# EAGLE design Relay_Board (EAGLE 7.7.0)
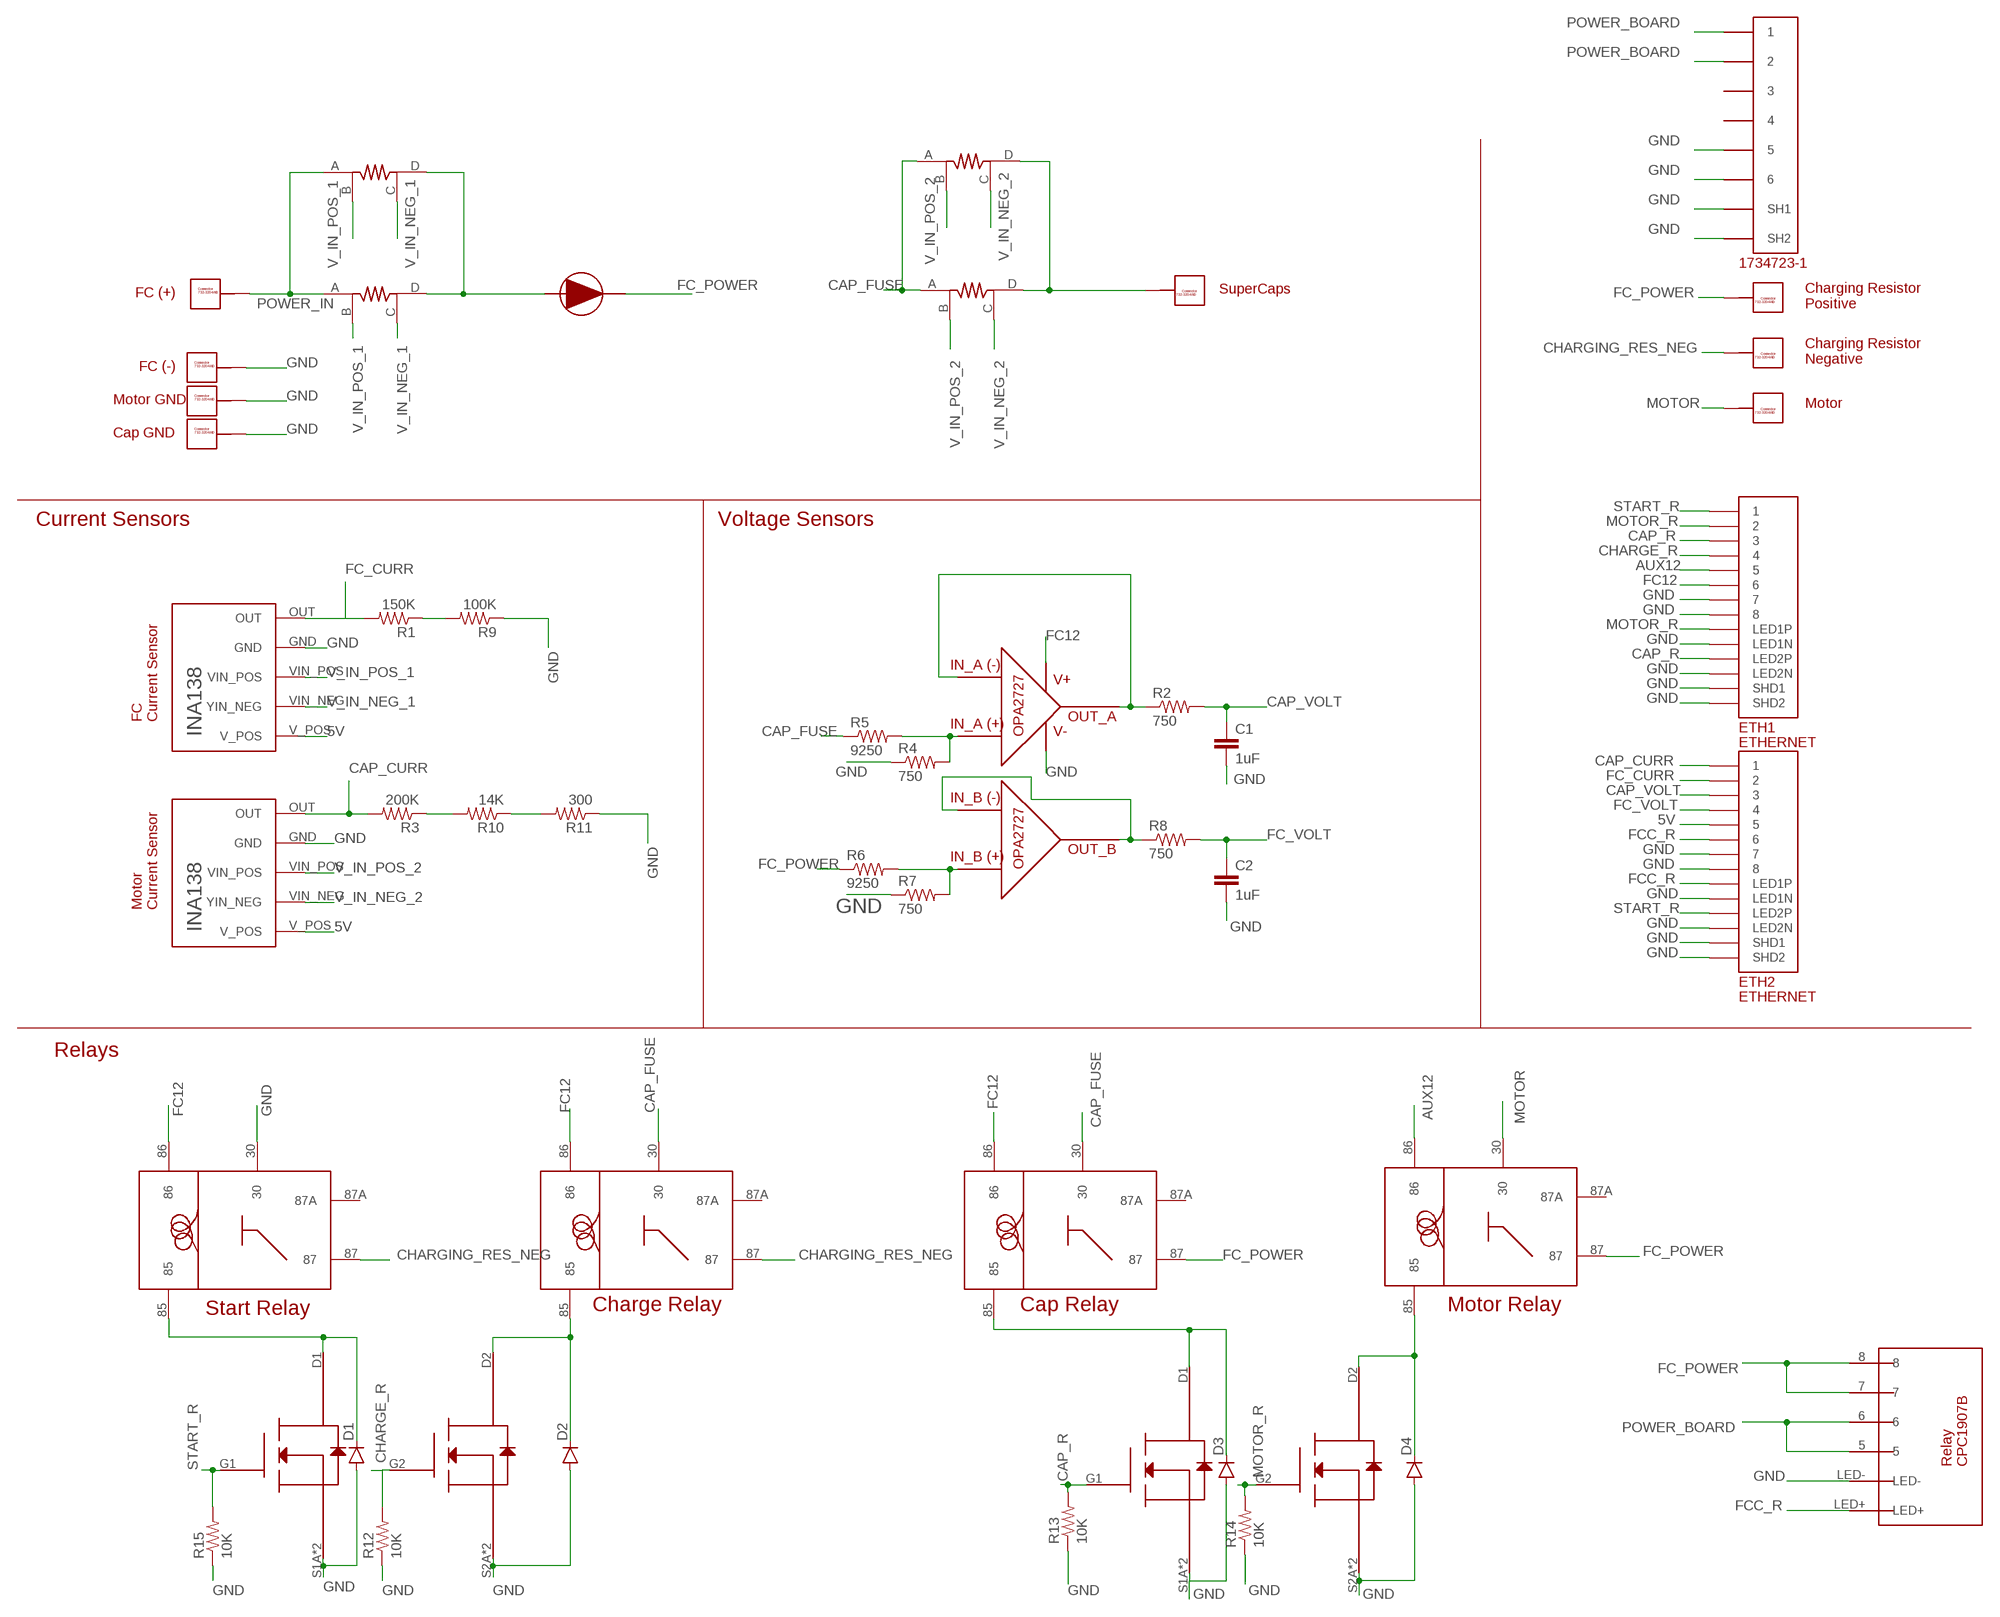
[diagram p0: schematic, sheet 1]

## Parts
C1  1uF  CAP0402-CAP  [0402-CAP]
C2  1uF  CAP0402-CAP  [0402-CAP]
D1  DIODESOD123  [SOD-123]
D2  DIODESOD123  [SOD-123]
D3  DIODESOD123  [SOD-123]
D4  DIODESOD123  [SOD-123]
ETH1  ETHERNET  [A122645-ND]
ETH2  ETHERNET  [A122645-ND]
R1  150K  RESISTOR1206  [1206]
R2  750  RESISTOR1206  [1206]
R3  200K  RESISTOR1206  [1206]
R4  750  RESISTOR1206  [1206]
R5  9250  RESISTOR1206  [1206]
R6  9250  RESISTOR1206  [1206]
R7  750  RESISTOR1206  [1206]
R8  750  RESISTOR1206  [1206]
R9  100K  RESISTOR1206  [1206]
R10  14K  RESISTOR1206  [1206]
R11  300  RESISTOR1206  [1206]
R12  10K  RESISTOR0603-RES  [0603-RES]
R13  10K  RESISTOR0603-RES  [0603-RES]
R14  10K  RESISTOR0603-RES  [0603-RES]
R15  10K  RESISTOR0603-RES  [0603-RES]
U$1  732-3204-ND_CONNECTOR  [732-3204-ND]
U$2  732-3204-ND_CONNECTOR  [732-3204-ND]
U$3  TI_INA138  [TI_INA138]
U$4  SHUNT_RESISTOR_CSM3637  [CSM3637]
U$5  DIODE-APT60S20BG  [DIODE-APT60S20BG]
U$6  SHUNT_RESISTOR_CSM3637  [CSM3637]
U$7  TI_INA138  [TI_INA138]
U$8  VCF4-1000  [VCF4-1000]
U$9  SI6926ADQ-T1-E3CT-ND_MOSFET  [SI6926ADQ-T1-E3CT-ND_MOSFET]
U$10  732-3204-ND_CONNECTOR  [732-3204-ND]
U$11  VCF4-1000  [VCF4-1000]
U$12  SHUNT_RESISTOR_CSM3637  [CSM3637]
U$13  732-3204-ND_CONNECTOR  [732-3204-ND]
U$14  732-3204-ND_CONNECTOR  [732-3204-ND]
U$15  VCF4-1000  [VCF4-1000]
U$17  OP-AMP_OPA2727AIDR  [OP-AMP_OPA2727AIDR]
U$18  VCF4-1000  [VCF4-1000]
U$19  5555140-6  [1734723-1_RJ11]
U$20  732-3204-ND_CONNECTOR  [732-3204-ND]
U$21  SHUNT_RESISTOR_CSM3637  [CSM3637]
U$22  RELAY-CPC1907B  [RELAY-CPC1907B]
U$23  732-3204-ND_CONNECTOR  [732-3204-ND]
U$24  732-3204-ND_CONNECTOR  [732-3204-ND]
U$25  SI6926ADQ-T1-E3CT-ND_MOSFET  [SI6926ADQ-T1-E3CT-ND_MOSFET]

## Nets
5V: ETH2.P$5 U$3.V_POS U$7.V_POS
AUX12: ETH1.P$5 U$18.86
CAP_CURR: ETH2.P$1 R3.2 U$3.OUT
CAP_FUSE: R5.1 U$8.30 U$11.30 U$12.A U$21.A
CAP_R: ETH1.P$3 ETH1.P$12(LED2P) R13.2 U$9.G1
CAP_VOLT: C1.1 ETH2.P$3 R2.2
CHARGE_R: ETH1.P$4 R12.2 U$25.G2
CHARGING_RES_NEG: U$11.87 U$14.P$1 U$14.P$2 U$14.P$3 U$14.P$4 U$14.P$5 U$14.P$6 U$14.P$7 U$14.P$8 U$14.P$9 U$14.P$10 U$15.87
FC12: ETH1.P$6 U$8.86 U$11.86 U$15.86 U$17.V+
FC_CURR: ETH2.P$2 R1.2 U$7.OUT
FC_POWER: R6.1 U$5.CATHODE U$8.87 U$13.P$1 U$13.P$2 U$13.P$3 U$13.P$4 U$13.P$5 U$13.P$6 U$13.P$7 U$13.P$8 U$13.P$9 U$13.P$10 U$18.87 U$22.7 U$22.8
FC_VOLT: C2.1 ETH2.P$4 R8.2
FCC_R: ETH2.P$6 ETH2.P$10(LED1P) U$22.LED+
GND: C1.2 C2.2 D1.A D2.A D3.A D4.A ETH1.P$7 ETH1.P$8 ETH1.P$9(LED1N) ETH1.P$11(LED2N) ETH1.P$13(SHD1) ETH1.P$14(SHD2) ETH2.P$7 ETH2.P$8 ETH2.P$9(LED1N) ETH2.P$11(LED2N) ETH2.P$13(SHD1) ETH2.P$14(SHD2) R4.1 R7.1 R9.1 R11.1 R12.1 R13.1 R14.1 R15.1 U$2.P$1 U$2.P$2 U$2.P$3 U$2.P$4 U$2.P$5 U$2.P$6 U$2.P$7 U$2.P$8 U$2.P$9 U$2.P$10 U$3.GND U$7.GND U$9.S1A(S1) U$9.S1B(S1) U$9.S2A(S2) U$9.S2B(S2) U$15.30 U$17.V- U$19.5 U$19.6 U$19.SH1 U$19.SH2 U$22.LED- U$23.P$1 U$23.P$2 U$23.P$3 U$23.P$4 U$23.P$5 U$23.P$6 U$23.P$7 U$23.P$8 U$23.P$9 U$23.P$10 U$24.P$1 U$24.P$2 U$24.P$3 U$24.P$4 U$24.P$5 U$24.P$6 U$24.P$7 U$24.P$8 U$24.P$9 U$24.P$10 U$25.S1A(S1) U$25.S1B(S1) U$25.S2A(S2) U$25.S2B(S2)
MOTOR: U$18.30 U$20.P$1 U$20.P$2 U$20.P$3 U$20.P$4 U$20.P$5 U$20.P$6 U$20.P$7 U$20.P$8 U$20.P$9 U$20.P$10
MOTOR_R: ETH1.P$2 ETH1.P$10(LED1P) R14.2 U$9.G2
N$1: R1.1 R9.2
N$3: D3.C U$8.85 U$9.D1
N$5: D1.C U$15.85 U$25.D1
N$7: D2.C U$11.85 U$25.D2
N$9: R4.2 R5.2 U$17.IN_A+
N$10: R6.2 R7.2 U$17.IN_B+
N$11: R8.1 U$17.IN_B- U$17.OUT_B
N$12: R2.1 U$17.IN_A- U$17.OUT_A
N$25: R3.1 R10.2
N$26: R10.1 R11.2
N$29: D4.C U$9.D2 U$18.85
POWER_BOARD: U$19.1 U$19.2 U$22.5 U$22.6
POWER_IN: U$1.P$1 U$1.P$2 U$1.P$3 U$1.P$4 U$1.P$5 U$1.P$6 U$1.P$7 U$1.P$8 U$1.P$9 U$1.P$10 U$4.A U$6.A
SHUNT_RES_1: U$4.D U$5.ANODE U$6.D
START_R: ETH1.P$1 ETH2.P$12(LED2P) R15.2 U$25.G1
SUPERCAPS: U$10.P$1 U$10.P$2 U$10.P$3 U$10.P$4 U$10.P$5 U$10.P$6 U$10.P$7 U$10.P$8 U$10.P$9 U$10.P$10 U$12.D U$21.D
V_IN_NEG_1: U$4.C U$6.C U$7.VIN_NEG(YIN_NEG)
V_IN_NEG_2: U$3.VIN_NEG(YIN_NEG) U$12.C U$21.C
V_IN_POS_1: U$4.B U$6.B U$7.VIN_POS
V_IN_POS_2: U$3.VIN_POS U$12.B U$21.B
Unconnected: U$8.87A U$11.87A U$15.87A U$18.87A U$19.3 U$19.4

## Notes on the sheet
- FC (+) | SuperCaps
- Charging Resistor
  Positive
- Charging Resistor
  Negative
- FC (-)
- Motor GND | Motor
- Cap GND
- Current Sensors | Voltage Sensors
- FC
  Current Sensor
- Motor
  Current Sensor
- Relays
- Start Relay | Charge Relay | Cap Relay | Motor Relay

## Library data of the parts
C1 C2 = SparkFun-Capacitors:CAP: Capacitor Standard 0603 ceramic capacitor, and 0.1" leaded capacitor.
D1-D4 = SparkFun-DiscreteSemi:DIODE: Diode These are standard reverse protection diodes and small signal diodes. SMA package can handle up to about 1A. SOD-323 can handle about 200mA. What the SOD-323 package when ordering, there are some mfgs out there that are 5-pin packages.
ETH1 ETH2 = ETHERNET-3:ETHERNET: Ethernet port with 2 leds. digikey number A122645-ND
R1-R15 = SparkFun-Passives:RESISTOR: Resistor Basic schematic elements and footprints for 0603, 1206, and PTH resistors.
U$1 U$2 U$10 U$13 U$14 U$20 U$23 U$24 = Connector 732-3204:732-3204-ND_CONNECTOR
U$3 U$7 = TI_INA138:TI_INA138: Texas Instruments INA138. Datasheet: http://www.ti.com/lit/ds/symlink/ina138.pdf
U$4 U$6 U$12 U$21 = Vishay_Shunt_Resistor_CSM3637:SHUNT_RESISTOR_CSM3637: Vishay Shunt Resistor CSM3637, 2-200 mOmh's Digikey Number: Y1488-.002BTR-ND; RESISTANCE: 2 - 200 mOhm's
U$5 = Diode_APT60S20BG-ND:DIODE-APT60S20BG
U$8 U$11 U$15 U$18 = VCF4-1000:VCF4-1000: Part for the VCF4-1000 relay socket. Digi-Key Part Number: PB232-ND. Pin numbering is directly taken from the data sheet of the relay. Relay Digi-Key Part Number: 255-2083-ND (Also works with 255-1825-ND). If using relay 255-1825-ND, ignore pin 87A.
U$9 U$25 = MOSFET Si6926ADQ:SI6926ADQ-T1-E3CT-ND_MOSFET
U$17 = OP_AMP_OPA2727AIDR:OP-AMP_OPA2727AIDR
U$19 = 5555140-6 RJ11:5555140-6
U$22 = Relay_CPC1907B:RELAY-CPC1907B

## Board
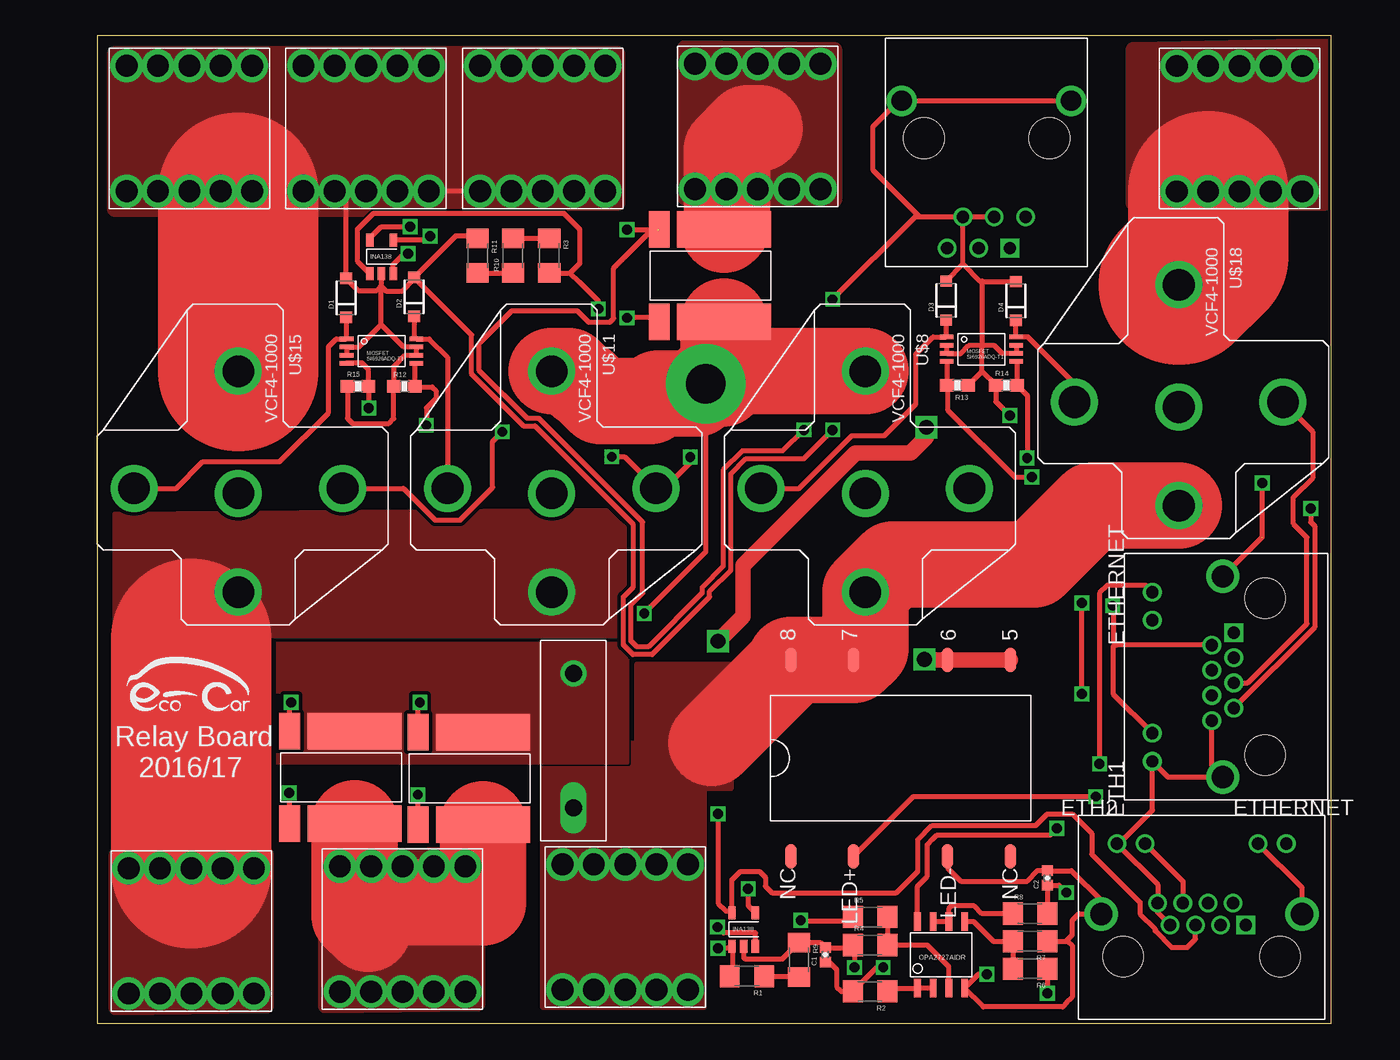
[diagram p1: board, top side]
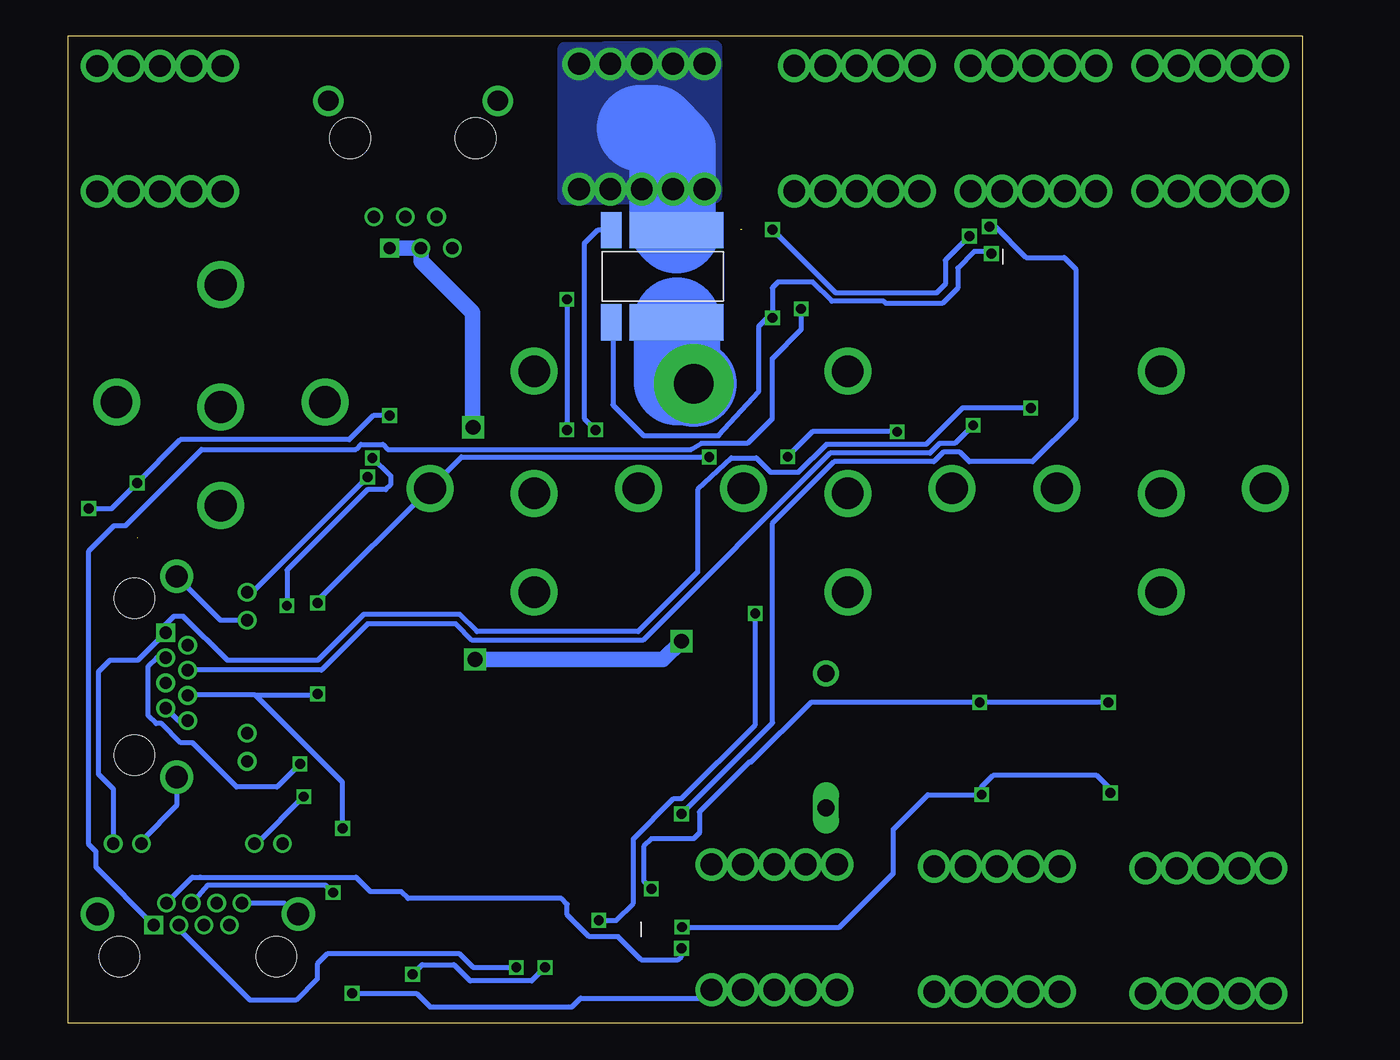
[diagram p2: board, bottom side, seen from below]

Size 100 x 80 mm. Coordinates in mm from the lower left corner, seen from the top.
Outline: 0,0 100,0 100,80 0,80 0,0
Copper layers (1*16): Top 0.035mm / dielectric 1.5mm / Bottom 0.035mm
Design rules "SeeedStudio_2layer_DRU_no_angle_20140221": minimum track width 6mil, minimum drill 12mil, track to track 6mil, track to pad 6mil, pad to pad 6mil, via to via 6mil, smd to smd 0mil, copper to edge 10mil, drill to drill 10mil, minimum pad ring 10mil, minimum via ring 6mil, stop-mask expansion 2mil, vias tented up to drill 100mil, thermal gap 10mil

### Footprints (pad centres in the part's own frame; a part is rotated, then mirrored left to right if it is on the bottom)
0402-CAP = smd 0.85 x 0.9: 1 -0.58,0; 2 0.58,0
SOD-123 = smd 0.9 x 0.95: A 1.575,0; C -1.575,0
A122645-ND = drill 1 square: P$1 3.58,2.54 | drill 1: P$2 2.56,4.32; P$3 1.54,2.54; P$4 0.52,4.32; P$5 -0.5,2.54; P$6 -1.52,4.32; P$7 -2.54,2.54; P$8 -3.56,4.32; P$9 -6.86,9.14; P$10 -4.57,9.14; P$11 4.57,9.14; P$12 6.86,9.14 | drill 1.8: P$13 -8.13,3.43; P$14 8.13,3.43 | hole 3.25: -6.35,0; 6.35,0
1206 = smd 1.6 x 1.8: 1 -1.4,0; 2 1.4,0
0603-RES = smd 1.1 x 1: 1 -0.85,0; 2 0.85,0
732-3204-ND = drill 1.76: P$1 -5.08,5.08; P$2 -2.54,5.08; P$3 0,5.08; P$4 2.54,5.08; P$5 5.08,5.08; P$6 5.08,-5.08; P$7 2.54,-5.08; P$8 0,-5.08; P$9 -2.54,-5.08; P$10 -5.08,-5.08
TI_INA138 = smd 1.05 x 0.6: GND 0,0; OUT 0,0.95; V_POS 2.7,0.95; VIN_NEG 2.7,-0.95; VIN_POS 0,-0.95
CSM3637 = smd 2.95 x 7.62: A -3.735,0; D 3.735,0 | smd 2.95 x 1.68: B -3.735,5.26; C 3.735,5.26
DIODE-APT60S20BG = drill 1.4: ANODE 5.45,0 | drill 1.4 long: CATHODE -5.45,0
VCF4-1000 = drill 2.57 pad 3.81: 30 -17.9,0; 85 -8.407,-8.445; 86 -8.407,8.445; 87 0,0; 87A -8,0
SI6926ADQ-T1-E3CT-ND_MOSFET = smd 1.1 x 0.356: D1 -2.82,0.992; D2 2.82,0.992; G1 -2.82,-0.992; G2 2.82,-0.992; S1A -2.82,0.331; S1B -2.82,-0.331; S2A 2.82,0.331; S2B 2.82,-0.331
OP-AMP_OPA2727AIDR = smd 1.5 x 0.55: IN_A+ -2.7,-0.635; IN_A- -2.7,0.635; IN_B+ 2.7,-1.905; IN_B- 2.7,-0.635; OUT_A -2.7,1.905; OUT_B 2.7,0.635; V+ 2.7,1.905; V- -2.7,-1.905
1734723-1_RJ11 = drill 1 square: 1 -2.54,2.54 | drill 1: 2 0,2.54; 3 2.54,2.54; 4 -3.81,0; 5 -1.27,0; 6 1.27,0 | drill 1.65: SH1 -7.5,-9.4; SH2 6.22,-9.4 | hole 3.3: -5.72,-6.35; 4.44,-6.35
RELAY-CPC1907B = smd 2 x 0.95: 5 7.95,-8.891; 6 7.95,-3.809; 7 7.95,3.811; 8 7.95,8.891; LED+ -7.95,3.811; LED- -7.95,-3.811; NC_1 -7.95,8.891; NC_2 -7.95,-8.891

### Placement (x,y rotation side)
C1  58.99,5.54 90 top
C2  76.98,11.76 90 top
D1  20.17,58.77 90 top
D2  25.67,58.85 90 top
D3  68.79,58.56 90 top
D4  74.44,58.52 90 top
ETH1  94.63,28.07 90 top
ETH2  89.48,5.4 0 top
R1  52.64,3.8 180 top
R2  62.62,2.57 180 top
R3  36.63,62.19 270 top
R4  62.62,6.33 0 top
R5  62.62,8.61 0 top
R6  75.58,4.41 180 top
R7  75.58,6.64 180 top
R8  75.58,8.87 0 top
R9  56.86,5.13 270 top
R10  33.69,62.19 90 top
R11  30.83,62.19 270 top
R12  24.9,51.59 0 top
R13  69.7,51.67 180 top
R14  73.66,51.69 0 top
R15  21.14,51.61 0 top
U$1  24.74,7.62 0 top
U$2  7.47,72.5 0 top
U$3  23.03,60.74 90 top
U$4  20.85,19.91 90 top
U$5  38.59,22.89 90 top
U$6  31.27,19.83 90 top
U$7  52.38,6.24 90 top
U$8  62.23,34.92 270 top
U$9  71.64,54.61 0 top
U$10  53.52,72.65 0 top
U$11  36.83,34.92 270 top
U$12  50.72,60.52 90 bottom
U$13  42.78,7.78 0 top
U$14  7.62,7.47 0 top
U$15  11.43,34.92 270 top
U$16  [LOGO]  7.78,27.07 0 top
U$17  68.37,5.54 90 top
U$18  87.63,41.93 270 top
U$19  71.41,65.34 180 top
U$20  92.55,72.49 0 top
U$21  50.8,60.57 90 top
U$22  65.09,21.48 90 top
U$23  36.09,72.5 0 top
U$24  21.78,72.5 0 top
U$25  23.03,54.46 0 top

### Tracks (layer width: path | path; a pad name or v marks a point on that pad's centre or on a via)
5V  (via drill 0.8)
  Top 0.406: U$3.V_POS 22.15,63.44 22.15,63.67 23.02,64.54 v25.35,64.54 | v50.31,16.95 50.31,9.72 50.93,9.1 51.27,9.1 U$7.V_POS 51.4,8.97 51.4,11.57 52.12,12.29 53.67,12.29 54.14,11.82 54.14,11.1 54.66,10.57 64.77,10.57 66.48,12.29 66.48,14.85 67.65,16.02 76.05,16.02 76.98,16.95 79,16.95 80.59,15.36 80.59,13.69 84.48,9.8 84.48,8.87 85.72,7.62 85.72,7.47 87.05,6.14 88.33,6.14 88.98,6.79 ETH2.P$5
  Bottom 0.406: v50.31,16.95 42.92,24.34 42.92,40.51 37.95,45.49 29.86,45.49 29.08,46.27 27.76,46.27 26.98,45.49 21.85,45.49 18.35,48.99 18.35,61.12 19.28,62.05 22.39,62.05 24.88,64.54 v25.35,64.54
AUX12
  Top 0.406: 92.5,27.57 ETH1.P$5 93.22,27.57 98.01,32.36 98.01,39.36 96.92,40.45 96.92,42.63 98.52,44.22 98.52,47.89 U$18.86
CAP_CURR  (via drill 0.8)
  Top 0.406: R3.2 38.32,60.79 | 38.32,60.79 39.11,61.58 39.11,64.3 37.79,65.63 22.39,65.63 21.07,64.3 21.07,61.75 U$3.OUT | 38.32,60.79 39.03,60.07 40.6,58.5 v40.6,57.87
  Bottom 0.406: ETH2.P$1 97.74,12.62 97.74,13.88 98.32,14.47 98.32,38.27 96.3,40.29 95.37,40.29 89.19,46.48 89.19,46.5 76.67,46.5 76.28,46.89 74.49,46.89 74.1,46.5 49.49,46.5 48.7,46.98 44.96,46.98 42.94,49.01 42.94,53.87 40.6,56.2 v40.6,57.87
CAP_FUSE  (via drill 0.8, 3.2 pad 6.45)
  Top 0.406: v56.99,8.32 57.02,8.3 60.91,8.3 R5.1 60.52,8.3 | v44.32,33.2 49.32,38.2 v49.32,51.81
  Top 7: U$8.30 50.34,52.83 v49.32,51.81 | v49.32,51.81 50.64,51.81 U$21.A | U$11.30 38.19,52.83 39.2,51.81 39.36,51.81 40.76,50.41 44.81,50.41 45.43,51.03 48.54,51.03 v49.32,51.81
  Bottom 0.406: v56.99,8.32 55.59,8.32 54.2,9.72 54.2,14.93 50.93,18.2 50.31,18.2 44.32,24.18 v44.32,33.2
  Bottom 7: U$12.A 50.64,56.94 50.64,51.96 49.47,51.96 v49.32,51.81
CAP_R  (via drill 0.8)
  Top 0.406: U$9.G1 68.85,53.59 R13.2 68.89,51.62 68.89,49.69 74.33,44.24 v75.73,44.24 | ETH1.P$12 84.95,35.47 81.83,35.47 81.21,34.85 v81.21,21
  Bottom 0.406: v75.73,44.24 85.05,34.93 ETH1.P$12 | v81.21,21 83.08,19.14 86.34,19.14 89.92,22.71 90.86,22.71 92.41,24.27 92.88,24.27 93.5,24.89 93.5,28.94 92.83,29.61 ETH1.P$3
CAP_VOLT  (via drill 0.8)
  Top 0.406: C1.1 59.3,4.96 59.9,4.36 59.9,2.96 60.28,2.57 R2.2 63.16,4.51 v63.68,4.51
  Bottom 0.406: ETH2.P$3 91.02,7.63 85.25,1.87 81.52,1.87 79.81,3.58 79.81,4.79 79,5.6 68.27,5.6 67.18,4.51 v63.68,4.51
CHARGE_R  (via drill 0.8)
  Top 0.406: U$25.G2 25.75,53.37 R12.2 25.78,51.55 27.14,51.55 27.45,51.24 27.45,50.62 26.67,49.84 v26.67,48.44
  Bottom 0.406: v26.67,48.44 28.15,46.96 29.39,46.96 30.17,46.19 38.26,46.19 53.42,31.02 67.26,31.02 68.58,32.35 75.73,32.35 79.47,28.61 90.29,28.61 ETH1.P$4
CHARGING_RES_NEG
  Top 0.406: U$15.87 7.62,31.12
  Top 13: 7.62,31.12 U$14.P$3
  pour Top (no thermals): 13.69,13.69 13.69,1.4 1.56,1.24 1.56,13.54
  pour Top (isolate 0.305, rank 2, no thermals): 42.16,40.61 41.23,41.54 1.4,41.23 1.4,31.43 43.09,31.43 43.09,39.83
FC12  (via drill 0.8)
  Top 0.406: U$17.V+ 66.46,11.1 67.26,11.9 67.26,14.46 67.72,14.93 | 48.05,45.49 v48.05,45.88 48.07,45.86 48.07,45.43 45.98,43.33 U$11.86 42.71,45.9 v41.69,45.9 | v79.78,26.67 v79.78,34.06 | 67.72,14.93 | 67.72,14.93 68.04,15.24 77.21,15.24 v77.76,15.78 | U$15.86 24.81,43.33 27.38,40.76 29.4,40.76 32.05,43.41 32.05,47.14 v32.83,47.92
  Bottom 0.406: v77.76,15.78 77.76,19.52 84.83,26.59 | 84.83,26.59 90.27,26.59 ETH1.P$6 | v48.05,45.88 48.36,45.88 68.13,45.88 U$8.86 79.78,34.23 v79.78,34.06 | 84.83,26.59 79.86,26.59 v79.78,26.67 | v32.83,47.92 39.67,47.92 v41.69,45.9
FC_CURR  (via drill 0.8)
  Top 0.406: R1.2 51.47,4.03 51.47,6.22 51.47,6.21 51.24,6.21 U$7.OUT 51.25,6.07 v50.31,6.07
  Bottom 0.406: ETH2.P$2 89.94,11.82 89.3,11.82 76.67,11.82 75.5,10.65 73.01,10.65 72.47,10.11 60.03,10.11 59.56,9.64 59.56,8.79 57.77,7 55.44,7 53.58,5.13 50.56,5.13 50.31,5.39 v50.31,6.07
FC_POWER  (via drill 0.8)
  Top 0.406: R6.1 v76.98,2.41
  Top 7: U$18.87 80.66,41.93 75.88,37.15 64.45,37.15 U$8.87 62.23,30.38 U$22.7 U$22.8 56.2,29.13 49.78,22.71
  Bottom 0.406: U$13.P$6 48.54,2.02 58.47,2.02 59.17,1.32 70.68,1.32 71.77,2.41 v76.98,2.41
  pour Top (rank 4, no thermals): 36.09,1.24 36.09,22.71 43.72,22.71 43.72,29.09 45.74,29.09 51.34,29.09 51.34,18.98 49.16,18.98 49.16,14.94 49.16,1.24
FC_VOLT  (via drill 0.8)
  Top 0.406: R8.2 C2.1 77.93,11.18 v78.53,10.57
  Bottom 0.406: ETH2.P$4 88.68,11.2 79.16,11.2 v78.53,10.57
FCC_R  (via drill 0.8)
  Top 0.406: U$22.LED+ 66.11,18.36 v80.9,18.36 | ETH2.P$10 87.96,11.49 ETH2.P$6
  Bottom 0.406: v80.9,18.36 84.71,14.54 ETH2.P$10
GND  (via drill 0.8)  (1 unrouted)
  Top 0.406: R11.1 31.01,63.78 29.02,63.78 D2.A | 23.02,59.72 23.4,59.33 24.73,59.33 25.67,60.27 D2.A | U$3.GND 23.02,60.72 23.02,59.72 | 23.02,59.72 22.9,59.6 | 22.9,59.6 22.63,59.33 21.19,59.33 D1.A 20.14,60.38 20.14,67.26 20.3,67.42 U$23.P$10 | U$25.S1B U$25.S1A 21.2,54.79 23.02,56.61 | 23.02,56.61 24.83,54.79 U$25.S2A U$25.S2B 25.84,54.12 24.96,54.12 24.05,53.21 R12.1 24.03,51.56 24.03,48.99 23.64,48.6 20.68,48.6 20.29,48.99 R15.1 | 23.02,56.61 23.02,59.48 22.9,59.6 | U$9.S1A U$9.S1B 69.98,54.27 70.6,54.9 71.69,54.9 | U$9.S2A U$9.S2B 73.32,54.27 72.7,54.9 71.69,54.9 | R14.1 72.79,51.67 | R13.1 71.69,52.81 | 71.69,52.81 71.69,54.9 | R14.1 71.69,52.81 | 71.69,60.13 71.69,54.9 | 78.53,1.63 79,2.1 79,6.3 78.66,6.64 R7.1 78.49,6.64 79,7.15 79,8.32 79.54,8.86 81.47,8.86 ETH2.P$13 81.35,9.94 78.94,12.34 C2.2 76.96,12.36 76.2,12.36 75.34,11.51 69.98,11.51 68.9,12.59 U$22.LED- | 78.53,1.63 | 78.53,1.63 78.22,1.32 71.79,1.32 U$17.V- 71.4,3.97 v72.08,3.97 | R14.1 72.81,50.35 v73.95,49.22 | ETH1.P$14 94.34,39.34 | 94.39,39.34 v94.39,43.78 | U$7.GND 52.38,5.32 52.48,5.21 55.54,5.21 R9.1 58.58,6.53 C1.2 61.01,6.12 R4.1 61.35,6.2 v61.35,4.51 | ETH1.P$7 98.64,32.07 98.64,40.29 98.32,40.6 v98.32,41.69 | ETH1.P$8 90.31,20.83 ETH1.P$13 86.76,19.94 ETH1.P$9 85.49,17.26 82.78,14.54 ETH2.P$9 85.92,11.24 ETH2.P$8 85.92,8.96 ETH2.P$7 | ETH2.P$11 97.61,10.98 ETH2.P$14 | D2.A 30.34,55.76 30.34,52.58 34.54,48.38 35.47,48.38 43.41,40.45 43.41,35.32 42.63,34.54 42.63,30.65 43.41,29.87 44.96,29.87 49.63,34.54 49.63,35 51.34,36.72 51.34,44.49 52.58,45.74 57.25,45.74 v59.59,48.07 | D3.A 70.14,61.48
  Top 0.406: 70.14,61.48 U$19.6 | U$19.6 U$19.5 | U$19.SH1 U$19.SH2 64.94,74.74 62.85,72.65 62.85,69.1 66.61,65.34 | 66.61,65.34 U$19.6 | 70.14,61.48 71.49,60.13 71.69,60.13 | 71.69,60.13 71.72,60.1 D4.A | v59.59,58.65 66.28,65.34 66.61,65.34
  Top 13: U$15.30 11.43,67.31
  Bottom 0.406: ETH2.P$13 82.47,9.72 ETH2.P$8 | ETH1.P$8 91.07,24.51 ETH1.P$7 | ETH1.P$13 91.2,17.63 94.05,14.78 ETH2.P$11 | v72.08,3.97 71.3,4.74 68.74,4.74 67.42,3.42 62.44,3.42 v61.35,4.51 | ETH1.P$11 87.64,32.64 ETH1.P$14 | v73.95,49.22 75.27,49.22 77.06,47.43 | 77.06,47.43 | 77.06,47.43 77.21,47.27 90.9,47.27 v94.39,43.78 96.48,41.69 v98.32,41.69 | v59.59,58.65 v59.59,48.07
  pour Top (no thermals): 1.4,65.96 1.4,78.57 42.16,78.57 42.16,66.43 37.49,66.43 37.49,65.96
MOTOR
  Top 13: U$18.30 90.01,62.21 U$20.P$9
  pour Top (no thermals): 83.95,66.42 83.95,78.87 99.41,79.19 99.41,66.42
MOTOR_R  (via drill 0.8)
  Top 0.406: U$9.G2 74.51,53.57 R14.2 75.34,50.85 v75.34,45.8 | v82.27,33.82 82.34,33.75 82.34,30.9 82.61,30.63 | ETH1.P$2 82.61,30.63 | 82.61,30.63 82.44,30.63 82.3,30.49 82.3,26.69 ETH1.P$10
  Bottom 0.406: v82.27,33.82 82.27,36.7 75.73,43.23 74.26,43.23 73.87,43.62 73.87,44.4 73.95,44.4 v75.34,45.8
N$1
  Top 0.406: R1.1 56.78,3.8 R9.2
N$3
  Top 0.406: U$8.85 56.87,43.33 61.14,47.61 63.78,47.61 66.33,50.15 66.33,54.2 67.72,55.59 U$9.D1 68.79,55.6 D3.C
N$5
  Top 0.406: U$15.85 6.4,43.33 8.55,45.49 14.77,45.49 18.74,49.45 18.74,54.82 19.36,55.44 20.2,55.44 U$25.D1 20.21,57.16 D1.C
N$7
  Top 0.406: D2.C 25.67,55.62 U$25.D2 25.85,55.44 26.9,55.44 28.38,53.96 U$11.85
N$9
  Top 0.406: U$17.IN_A+ 68.97,2.87 68.97,4.59 67.23,6.33 R4.2 | R5.2 R4.2 | R4.2
N$10
  Top 0.406: R6.2 R7.2 74.15,6.61 72.62,6.61 71,8.23 U$17.IN_B+
N$11
  Top 0.406: U$17.OUT_B U$17.IN_B- 68.97,8.27 68.97,9.25 69.2,9.49 71.07,9.49 71.69,8.87 R8.1
N$12
  Top 0.406: U$17.IN_A- U$17.OUT_A | 66.42,2.88 U$17.OUT_A | R2.1 64.29,2.83 U$17.OUT_A
N$25
  Top 0.406: R10.2 R3.1
N$26
  Top 0.406: R11.2 R10.1
N$29
  Top 0.406: U$18.85 79.18,51.83 75.42,55.59 U$9.D2 | U$9.D2 | U$9.D2 74.44,55.59 D4.C
POWER_BOARD  (via drill 1.2)
  Top 1.27: U$22.5 U$22.6 67.07,29.43 v67.03,29.47 | v50.31,30.95 52.33,32.97 52.33,37.08 61.45,46.21 65.88,46.21 67.18,47.51 v67.18,48.29
  Bottom 1.27: v50.31,30.95 51.78,29.47 v67.03,29.47 | v67.18,48.29 67.21,48.31 67.21,57.56 71.41,61.76 U$19.2 U$19.1
POWER_IN
  Top 7: U$4.A 20.85,8.71 21.94,7.62 | U$6.A 31.27,9.8 22.71,9.8
  pour Top (no thermals): 18.51,1.4 18.51,13.54 30.8,13.69 30.8,1.56
SHUNT_RES_1
  pour Top (isolate 0.305, rank 3, no thermals): 14.16,21.16 42.94,21.16 42.94,34.23 14.62,34.23 14,33.6
START_R  (via drill 0.8)
  Top 0.406: U$25.G1 20.23,53.5 21.46,53.5 21.99,52.97 R15.2 21.99,49.86 v22,49.84
  Bottom 0.406: v22,49.84 27.53,49.84 30.48,46.89 38.57,46.89 40.8,44.65 43.09,44.65 44.24,45.8 46.27,45.8 48.99,43.23 48.99,36.55 53.81,31.72 66.87,31.72 68.27,33.12 76.05,33.12 79.78,29.39 87.09,29.39 90.66,32.97 91.44,32.97 92.09,32.32 ETH1.P$1 94.34,29.4 96.61,29.4 97.55,28.47 97.55,20.19 96.34,18.98 ETH2.P$12
SUPERCAPS
  Top 7: U$21.D 51.03,64.54 51.03,70.79 52.74,72.5 53.67,72.5
  Bottom 7: U$12.D 51.03,64.56 51.03,70.94 52.58,72.5 53.67,72.5
  pour Top (no thermals): 47.61,79.03 59.74,78.88 59.74,66.74 47.61,66.9
  pour Bottom (no thermals): 47.61,67.05 47.61,79.03 59.74,78.88 59.74,66.9
V_IN_NEG_1  (via drill 0.8)
  Top 0.406: U$6.C 26.01,25.85 v26.14,25.98 | v52.74,10.89 52.74,9.53 U$7.VIN_NEG | U$4.C 15.59,25.86 v15.71,25.98
  Bottom 0.406: v52.74,10.89 53.36,11.51 53.36,14.31 52.74,14.94 49.32,14.94 48.85,15.4 48.85,17.11 44.81,21.16 44.65,21.16 39.83,25.98 v26.14,25.98 v15.71,25.98
V_IN_NEG_2  (via drill 0.8)  (1 unrouted)
  Top 0.406: v42.92,64.3 44.96,64.3 | 44.96,64.3 45.38,64.3 | U$3.VIN_NEG 24.02,63.48 26.45,63.48 26.73,63.76 v26.98,63.76 | v57.25,48.07 55.54,46.36 52.27,46.36 50.72,44.81 50.72,37.03 49.01,35.32 49.01,34.85 44.65,30.49 43.72,30.49 43.25,30.96 43.25,33.91 44.18,34.85 44.18,40.6 35.78,49.01 34.85,49.01 30.96,52.9 30.96,55.07 33.6,57.72 38.89,57.72 39.83,56.78 41.54,56.78 41.85,57.1 41.85,61.19 44.96,64.3
  Bottom 0.406: v42.92,64.3 37.79,59.17 29.62,59.17 28.93,59.87 28.93,61.82 v26.98,63.76 | U$12.C 57.09,64.25 58.19,63.16 58.19,49.01 v57.25,48.07
V_IN_POS_1  (via drill 0.8)
  Top 0.406: U$7.VIN_POS 53.33,7.28 53.36,7.31 50.72,7.31 v50.25,7.78 | U$6.B 25.98,16.12 v25.98,18.51 | U$4.B 15.59,18.64 v15.56,18.67
  Bottom 0.406: v50.25,7.78 37.49,7.78 33.14,12.13 33.14,15.71 30.34,18.51 v25.98,18.51 25.98,19.14 25.05,20.07 16.65,20.07 15.56,18.98 v15.56,18.67
V_IN_POS_2  (via drill 0.8)
  Top 0.406: U$3.VIN_POS 23.98,61.46 24.88,62.36 v25.19,62.36 | U$21.B 45.06,57.15 v42.92,57.15
  Bottom 0.406: v25.19,62.36 25.35,62.52 26.59,62.52 27.91,61.19 27.91,59.56 29.16,58.32 33.74,58.32 33.91,58.5 38.12,58.5 39.67,60.05 42.47,60.05 42.94,59.59 42.94,57.17 v42.92,57.15 43.35,57.15 44.03,56.47 44.03,51.18 47.3,47.61 53.36,47.61 55.85,50.09 55.85,56.81 U$12.B

### Text on the board
tPlace: Relay Board / 2016/17